# EAGLE design edge (EAGLE 9.2.2)
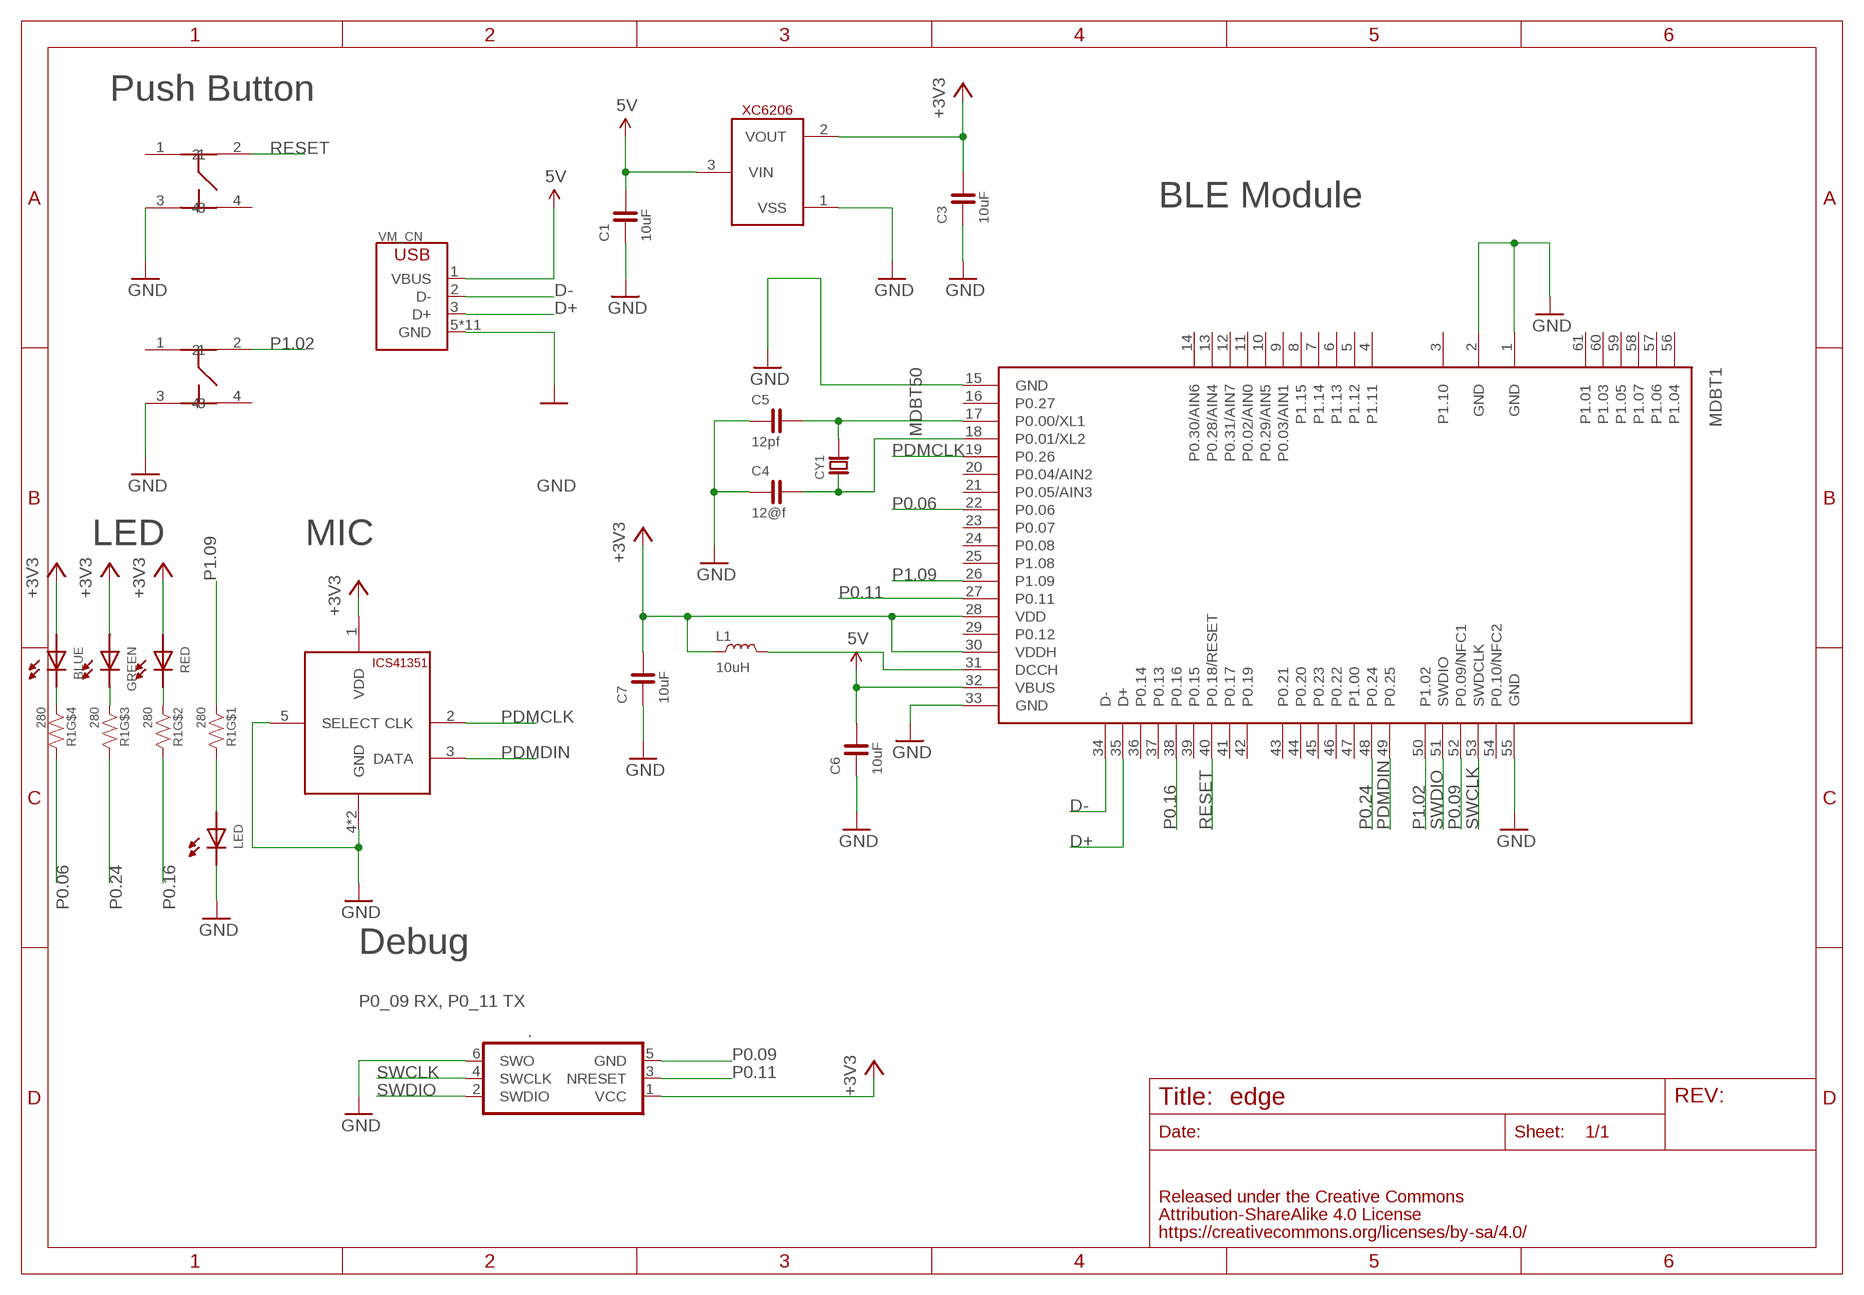
[diagram p0: schematic, sheet 1]

## Parts
.  TC2030-IDC-NL  [TC2030-IDC-NL]
BLUE  LED-0603  [0603]
C1  10uF  CAPACITOR-0603  [0603]
C3  10uF  CAPACITOR-0603  [0603]
C4  12@f  CAPACITOR-0603  [0603]
C5  12pf  CAPACITOR-0603  [0603]
C6  10uF  CAPACITOR-0603  [0603]
C7  10uF  CAPACITOR-0603  [0603]
CY1  CRYSTAL-ABS07  [ABRACON-ABS07-32.768KHZ]
GREEN  LED-0603  [0603]
IC1  XC6206  [SOT-23]
L1  10uH  COIL-0603  [0603]
LED  LED-0603  [0603]
MDBT1  MDBT50  [MDBT50]
MIC1  TDK-ICS41351  [ICS41351]
R1  280  RESISTOR_ARRAY  [EXBV8V]
RED  LED-0603  [0603]
U$1  SWICTH-4P(KMR2)  [SWITCH-4P(KMR2)]
U$5  SWICTH-4P(KMR2)  [SWITCH-4P(KMR2)]
VM_CN  USB-ZX62D  [ZX62D-B-5PA8]

## Nets
5V: C1.2 C6.2 IC1.3(VIN) MDBT1.32(VBUS) VM_CN.1(VBUS)
+3V3: ..1(VCC) BLUE.ANODE C3.2 C7.2 GREEN.ANODE IC1.2(VOUT) L1.1 MDBT1.28(VDD) MDBT1.30(VDDH) MIC1.1(VDD) RED.ANODE
D+: MDBT1.35(D+) VM_CN.3(D+)
D-: MDBT1.34(D-) VM_CN.2(D-)
GND: ..6(SWO) C1.1 C3.1 C4.1 C5.1 C6.1 C7.1 IC1.1(VSS) LED.CATHODE MDBT1.1(GND) MDBT1.2(GND) MDBT1.15(GND) MDBT1.33(GND) MDBT1.55(GND) MIC1.4(GND) MIC1.5(SELECT) MIC1.6(GND) U$1.3 U$5.3 VM_CN.5(GND) VM_CN.B1(GND) VM_CN.B2(GND) VM_CN.B3(GND) VM_CN.B4(GND) VM_CN.T1(GND) VM_CN.T2(GND) VM_CN.T3(GND) VM_CN.T4(GND) VM_CN.T5(GND) VM_CN.T6(GND)
N$1: BLUE.CATHODE R1.4
N$2: GREEN.CATHODE R1.3
N$3: R1.2 RED.CATHODE
N$4: L1.2 MDBT1.31(DCCH)
N$5: LED.ANODE R1.8
N$7: C5.2 CY1.P$2 MDBT1.17(P0.00/XL1)
N$8: C4.2 CY1.P$1 MDBT1.18(P0.01/XL2)
P0.06: MDBT1.22(P0.06) R1.5
P0.09: ..5(GND) MDBT1.52(P0.09/NFC1)
P0.11: ..3(NRESET) MDBT1.27(P0.11)
P0.16: MDBT1.38(P0.16) R1.7
P0.24: MDBT1.48(P0.24) R1.6
P1.02: MDBT1.50(P1.02) U$1.2
P1.09: MDBT1.26(P1.09) R1.1
PDMCLK: MDBT1.19(P0.26) MIC1.2(CLK)
PDMDIN: MDBT1.49(P0.25) MIC1.3(DATA)
RESET: MDBT1.40(P0.18/RESET) U$5.2
SWCLK: ..4(SWCLK) MDBT1.53(SWDCLK)
SWDIO: ..2(SWDIO) MDBT1.51(SWDIO)
Unconnected: MDBT1.3(P1.10) MDBT1.4(P1.11) MDBT1.5(P1.12) MDBT1.6(P1.13) MDBT1.7(P1.14) MDBT1.8(P1.15) MDBT1.9(P0.03/AIN1) MDBT1.10(P0.29/AIN5) MDBT1.11(P0.02/AIN0) MDBT1.12(P0.31/AIN7) MDBT1.13(P0.28/AIN4) MDBT1.14(P0.30/AIN6) MDBT1.16(P0.27) MDBT1.20(P0.04/AIN2) MDBT1.21(P0.05/AIN3) MDBT1.23(P0.07) MDBT1.24(P0.08) MDBT1.25(P1.08) MDBT1.29(P0.12) MDBT1.36(P0.14) MDBT1.37(P0.13) MDBT1.39(P0.15) MDBT1.41(P0.17) MDBT1.42(P0.19) MDBT1.43(P0.21) MDBT1.44(P0.20) MDBT1.45(P0.23) MDBT1.46(P0.22) MDBT1.47(P1.00) MDBT1.54(P0.10/NFC2) MDBT1.56(P1.04) MDBT1.57(P1.06) MDBT1.58(P1.07) MDBT1.59(P1.05) MDBT1.60(P1.03) MDBT1.61(P1.01) U$1.1 U$1.4 U$5.1 U$5.4

## Notes on the sheet
- Push Button
- BLE Module
- LED | MIC
- Debug
- P0_09 RX, P0_11 TX

## Library data of the parts
. = TagConnect:TC2030-IDC: Tag-Connect In Circuit Programming & Debug Cable 6 Pin http://www.tag-connect.com
BLUE GREEN LED RED = FaBo-LED:LED
C1 C3-C7 = FaBo-Capacitor:CAPACITOR: CAPACITOR
CY1 = FaBo-Crystal:CRYSTAL
IC1 = FaBo-VoltageRegulator:XC6206
L1 = FaBo-Coil:COIL: RESISTOR
MDBT1 = MDBT50Q_171031:MDBT50: Raytac Corporation MDBT50 Bluetooth Low Energy Module based on Noridc nRF52840 Source: Raytac datasheet
MIC1 = FaBo-Sound:TDK-ICS41351
R1 = component:RESISTOR_ARRAY
U$1 U$5 = gclue-test:SWICTH-4P(KMR2)
VM_CN = component:USB

## Board
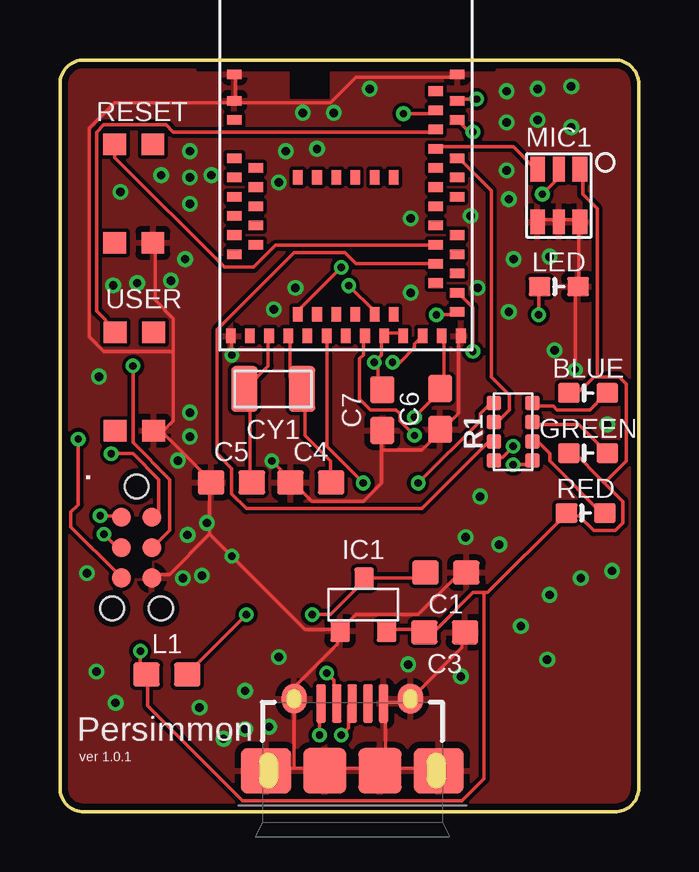
[diagram p1: board, top side]
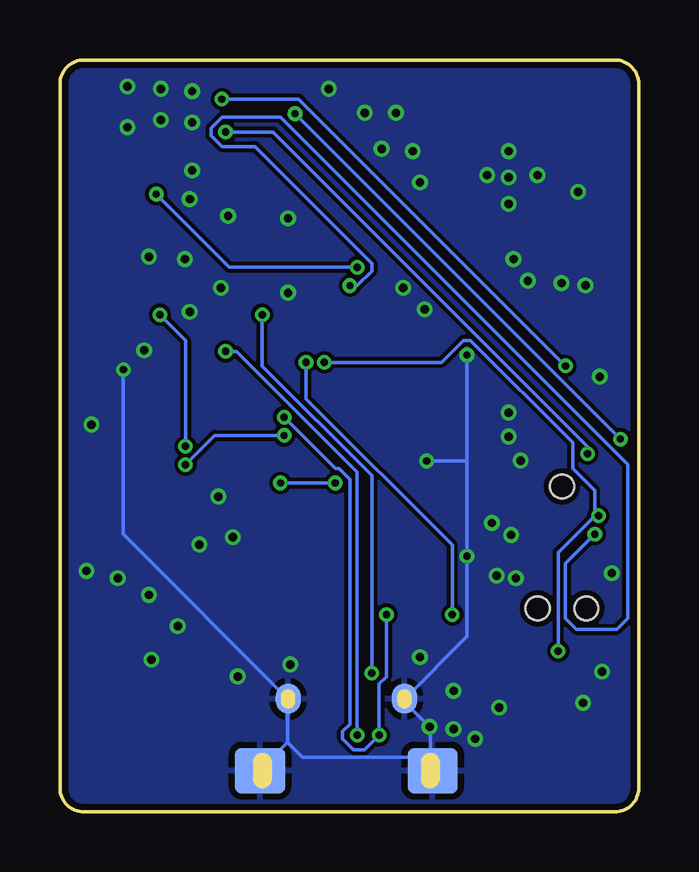
[diagram p2: board, bottom side, seen from below]

Size 24.13 x 31.35 mm. Coordinates in mm from the lower left corner, seen from the top.
Outline: 24.13,30.35 24.13,1 arc-90 23.13,0 1,0 arc-90 0,1 0,30.35 arc-90 1,31.35 23.13,31.35 arc-90 24.13,30.35
Copper layers (1*16): Top 0.035mm / dielectric 1.5mm / Bottom 0.035mm
Design rules "SeeedStudio_2layer_DRU_no_angle_20140221": minimum track width 6mil, minimum drill 12mil, track to track 6mil, track to pad 6mil, pad to pad 6mil, via to via 6mil, smd to smd 0mil, copper to edge 10mil, drill to drill 10mil, minimum pad ring 10mil, minimum via ring 6mil, stop-mask expansion 2mil, vias tented up to drill 100mil, thermal gap 10mil

### Footprints (pad centres in the part's own frame; a part is rotated, then mirrored left to right if it is on the bottom)
TC2030-IDC-NL = smd 0.787 x 0.787: 1 -1.27,-0.635; 2 -1.27,0.635; 3 0,-0.635; 4 0,0.635; 5 1.27,-0.635; 6 1.27,0.635 | hole 0.991: -2.54,0; 2.54,1.016; 2.54,-1.016
0603 = smd 0.9 x 0.8: ANODE -0.8,0; CATHODE 0.8,0
0603' = smd 1.1 x 1: 1 -0.85,0; 2 0.85,0
ABRACON-ABS07-32.768KHZ = smd 1.1 x 1.9: P$1 -1.2,0; P$2 1.2,0
SOT-23 = smd 0.8 x 0.9: 1 -0.97,-1.1; 2 0.97,-1.1; 3 0.03,1.1
MDBT50 = smd 0.6 x 0.4: 1 -4.65,3.75; 2 -4.65,2.65; 3 -4.65,1.85; 4 -4.65,0.25; 5 -3.75,-0.15; 6 -4.65,-0.55; 7 -3.75,-0.95; 8 -4.65,-1.35; 9 -3.75,-1.75; 10 -4.65,-2.15; 11 -3.75,-2.55; 12 -4.65,-2.95; 13 -3.75,-3.35; 14 -4.65,-3.75; 34 4.65,-6.15; 35 4.65,-5.35; 36 3.75,-4.95; 37 4.65,-4.55; 38 3.75,-4.15; 39 4.65,-3.75; 40 3.75,-3.35; 41 4.65,-2.95; 42 3.75,-2.55; 43 3.75,-1.75; 44 4.65,-1.35; 45 3.75,-0.95; 46 4.65,-0.55; 47 3.75,-0.15; 48 4.65,0.25; 49 3.75,0.65; 50 3.75,1.45; 51 4.65,1.85; 52 3.75,2.25; 53 4.65,2.65; 54 3.75,3.05; 55 4.65,3.75 | smd 0.4 x 0.6: 15 -4.8,-7.15; 16 -4,-7.15; 17 -3.2,-7.15; 18 -2.4,-7.15; 19 -2,-6.25; 20 -1.6,-7.15; 21 -1.2,-6.25; 22 -0.8,-7.15; 23 -0.4,-6.25; 24 0,-7.15; 25 0.4,-6.25; 26 0.8,-7.15; 27 1.2,-6.25; 28 1.6,-7.15; 29 2,-6.25; 30 2.4,-7.15; 31 3.2,-7.15; 32 4,-7.15; 33 4.8,-7.15; 56 -2,-0.55; 57 -1.2,-0.55; 58 -0.4,-0.55; 59 0.4,-0.55; 60 1.2,-0.55; 61 2,-0.55
ICS41351 = smd 0.622 x 1.03: 1 0.884,1.1; 3 -0.884,1.1; 4 -0.884,-1.1; 6 0.884,-1.1 | smd 0.5 x 1.03: 2 0,1.1; 5 0,-1.1
EXBV8V = smd 0.6 x 0.6: 1 -1.2,-0.8; 2 -0.4,-0.8; 3 0.4,-0.8; 4 1.2,-0.8; 5 1.2,0.8; 6 0.4,0.8; 7 -0.4,0.8; 8 -1.2,0.8
SWITCH-4P(KMR2) = smd 0.9 x 0.95: 1 -1,0; 2 3.1,0; 3 -1,-1.6; 4 3.1,-1.6
ZX62D-B-5PA8 = smd 0.4 x 1.6: 1 -1.3,4.25; 2 -0.65,4.25; 3 0,4.25; 4 0.65,4.25; 5 1.3,4.25 | smd 1.05 x 1.25 bottom: B1 -2.425,4.45; B2 2.425,4.45 | smd 2.1 x 1.9 bottom: B3 -3.6,1.45; B4 3.6,1.45 | smd 1.05 x 1.25: T1 -2.425,4.45; T2 2.425,4.45 | smd 2.1 x 1.9: T3 -3.6,1.45; T6 3.6,1.45 | smd 1.8 x 1.9: T4 -1.15,1.45; T5 1.15,1.45

### Placement (x,y rotation side)
.  3.19,11.03 270 top
BLUE  22.02,17.47 0 top
C1  10uF  [0603']  16.09,9.98 180 top
C3  10uF  [0603']  16.04,7.49 180 top
C4  12@f  [0603']  10.46,13.74 0 top
C5  12pf  [0603']  7.15,13.74 0 top
C6  10uF  [0603']  15.85,16.8 90 top
C7  10uF  [0603']  13.44,16.75 90 top
CY1  8.89,17.64 180 top
GREEN  22.02,14.96 0 top
IC1  12.65,8.64 0 top
L1  10uH  [0603']  4.46,5.73 0 top
LED  20.8,21.9 0 top
MDBT1  11.92,27 0 top
MIC1  20.8,25.7 0 top
R1  18.9,15.85 90 top
RED  21.92,12.46 0 top
U$1  2.3,16.9 90 top
U$5  2.28,24.73 90 top
VM_CN  12.19,0.27 0 top

### Tracks (layer width: path | path; a pad name or v marks a point on that pad's centre or on a via)
5V  (via drill 0.3)
  Top 0.152: MDBT1.32 16,19.81 16,17.68 C6.2 15.85,17.53 v14.78,16.46 | C1.2 15.24,9.91 15.09,9.75 12.8,9.75 IC1.3 12.65,9.6 11.28,8.23 v10.52,8.23 | v10.82,3.2 10.82,4.42 VM_CN.1
  Bottom 0.152: v10.52,8.23 10.52,5.64 10.82,5.33 v10.82,3.2 11.43,2.59 11.89,2.59 12.34,3.05 12.34,3.35 12.04,3.66 12.04,13.87 12.5,14.33 12.65,14.33 v14.78,16.46
+3V3  (via drill 0.3)
  Top 0.152: MDBT1.30 14.17,19.96 13.56,19.96 MDBT1.28 13.41,19.81 13.41,19.05 13.26,18.9 13.26,18.75 | 13.26,18.75 13.26,17.83 13.41,17.68 C7.2 | v1.68,12.34 2.44,12.34 ..1 | v3.35,6.71 3.35,5.94 3.5,5.79 L1.1 3.66,5.64 3.66,4.42 7.62,0.46 16.76,0.46 17.68,1.37 17.68,9.14 | v13.11,18.75 13.26,18.75 | IC1.2 13.72,7.62 15.09,7.62 C3.2 15.24,7.62 15.7,7.62 17.22,9.14 17.68,9.14 | 22.71,13.72 21.34,15.09 GREEN.ANODE | 22.71,13.72 23.47,12.95 23.47,12.04 23.16,11.73 22.25,11.73 21.64,12.34 21.18,12.34 RED.ANODE 21.03,12.34 17.83,9.14 17.68,9.14 | 22.4,18.14 23.32,18.14 23.62,17.83 23.62,14.63 22.71,13.72 | 22.4,18.14 22.25,18.14 21.64,17.53 21.34,17.53 BLUE.ANODE | 22.4,18.14 22.4,25.15 21.79,25.76 21.79,26.67 MIC1.1
  Bottom 0.152: 1.83,12.34 3.35,10.82 v3.35,6.71 | v13.11,18.75 8.23,18.75 7.32,19.66 7.01,19.66 2.74,15.39 2.74,14.33 1.83,13.41 1.83,12.34 | 1.83,12.34 v1.68,12.34
D+  (via drill 0.3)
  Top 0.152: v17.22,19.2 17.22,21.03 16.61,21.64 MDBT1.35 | v11.73,3.2 12.04,3.5 12.04,4.42 VM_CN.3
  Bottom 0.152: v17.22,19.2 16.76,19.2 11.73,14.17 v11.73,3.2
D-  (via drill 0.3)
  Top 0.152: v15.7,20.73 16.46,20.73 MDBT1.34 | v11.12,5.79 11.43,5.49 11.43,4.57 VM_CN.2
  Bottom 0.152: v15.7,20.73 15.7,18.59 11.12,14.02 v11.12,5.79
GND  (via drill 0.3, 0.35)
  Top 0.152: MDBT1.33 16.61,19.81 16.61,16.61 16,16 C6.1 15.85,15.85 15.09,15.09 13.41,15.09 | 13.41,15.09 13.41,15.85 C7.1 | 13.41,15.09 13.41,13.72 12.65,12.95 10.52,12.95 9.75,13.72 C4.1 9.6,13.87 v8.84,14.63 | v7.16,19.05 7.16,19.81 MDBT1.15 | MIC1.4 19.96,24.69 20.73,24.69 MIC1.5 20.88,24.69 21.64,24.69 MIC1.6 21.64,24.54 21.64,21.95 LED.CATHODE 21.49,21.79 v21.49,18.44 | IC1.1 11.58,7.47 11.58,7.01 9.91,5.33 9.91,4.72 VM_CN.T1 9.75,4.57 9.75,1.83 | C1.1 16.92,9.91 16.61,9.91 14.94,8.23 12.34,8.23 11.73,7.62 IC1.1 | C3.1 16.76,7.47 16.76,6.86 14.63,4.72 VM_CN.B2 14.48,4.57 13.56,4.57 VM_CN.5 13.56,4.42 13.56,1.83 | VM_CN.T5 13.26,1.83 11.12,1.83 VM_CN.T4 10.97,1.83 9.75,1.83 | 9.75,1.83 8.69,1.83 VM_CN.T3 | 13.56,1.83 13.41,1.83 VM_CN.T5 | 13.56,1.83 15.7,1.83 VM_CN.B4 | 13.56,1.83 VM_CN.T5 | MDBT1.2 7.32,29.72 7.32,30.63 MDBT1.1 | MDBT1.55 16.46,30.63 12.34,30.63 11.28,29.57 7.32,29.57 MDBT1.2 | 6.25,11.58 4.57,9.91 3.96,9.91 ..6 | 6.25,11.58 6.25,13.72 C5.1 6.25,13.87 4.27,15.85 | 4.27,15.85 3.96,15.85 U$1.3 4.27,15.85 | 4.72,19.2 4.72,16.31 4.27,15.85 | 4.72,19.2 4.72,20.57 3.96,21.34 3.96,23.62 U$5.3 | 4.72,19.2 1.83,19.2 1.22,19.81 1.22,28.5 2.29,29.57 7.16,29.57 MDBT1.2 | 6.25,11.58 v7.16,10.67 10.21,7.62 11.58,7.62 IC1.1
  Bottom 0.152: 7.16,14.63 v7.16,10.67 7.16,7.32 9.75,4.72 VM_CN.T1 9.75,4.57 8.69,3.5 8.69,2.29 | 7.16,14.63 v7.16,19.05 | 8.69,2.29 8.69,1.83 VM_CN.T3 8.69,2.29 | 7.16,14.63 v8.84,14.63 | 14.63,2.9 14.63,4.57 VM_CN.B2 14.63,4.72 21.49,11.58 v21.49,18.44 | 14.63,2.9 15.7,1.83 VM_CN.B4 | 8.69,2.29 14.02,2.29 14.63,2.9
  other vias: 20.32,6.35 17.52,13.15 14.62,21.65 9.82,21.85 14.62,24.75 5.42,27.55 5.42,26.45 9.42,27.55 9.12,26.25 5.42,25.35 2.52,25.85 5.22,23.05 4.62,22.15 3.22,22.05 2.22,21.95 5.42,16.65 5.42,15.65 6.12,12.05 8.72,3.55 7.72,3.45 6.82,3.05 10.12,29.15 11.42,29.15 12.92,30.15 18.62,30.05 18.62,28.75 19.92,28.85 19.92,30.15 18.62,26.75 17.12,24.85 17.42,21.85 18.92,23.05 20.42,23.15 18.72,20.85 20.62,19.25 10.72,27.65 6.32,26.55 4.22,26.55 1.62,18.15 4.92,14.65 5.32,11.55 5.92,9.85 5.12,9.75 1.12,9.95 1.52,5.85 2.32,4.55 7.72,5.05 9.12,6.45 5.82,4.35 16.72,5.65 14.52,6.15 23.02,10.05 21.72,9.75 20.42,9.05 19.22,7.75 16.92,11.45 18.32,11.15 22.82,16.15 21.32,30.25 21.32,28.55 18.72,25.55 8.92,20.95
  pour Top: 0,0 24.13,0 24.13,31.75 0,31.75
  pour Bottom: 0,0 24.13,0 24.13,31.75 0,31.75
N$1
  Top 0.152: R1.4 19.81,16.92 20.57,16.92 20.73,16.76 22.1,16.76 22.71,17.37 BLUE.CATHODE
N$2
  Top 0.152: R1.3 19.81,16.15 21.64,16.15 22.71,15.09 GREEN.CATHODE
N$3
  Top 0.152: R1.2 19.81,15.39 19.96,15.39 20.42,14.94 20.42,14.63 22.71,12.34 RED.CATHODE
N$4  (via drill 0.3)
  Top 0.152: v13.87,18.75 14.17,18.75 14.78,19.36 14.78,19.51 15.09,19.81 MDBT1.31 | v7.77,8.23 5.33,5.79 L1.2
  Bottom 0.152: v13.87,18.75 13.87,17.22 7.77,11.12 v7.77,8.23
N$5  (via drill 0.3)
  Top 0.152: v18.9,15.24 18.44,14.78 18.14,14.78 R1.8 | v19.96,20.73 19.96,21.79 LED.ANODE
  Bottom 0.152: v18.9,15.24 18.9,19.66 v19.96,20.73
N$7
  Top 0.152: MDBT1.17 8.69,19.81 8.69,18.59 7.77,17.68 CY1.P$2 7.77,17.53 7.92,17.37 7.92,13.87 C5.2
N$8
  Top 0.152: MDBT1.18 9.6,19.81 9.6,18.14 10.06,17.68 CY1.P$1 10.21,17.53 10.21,15.7 11.28,14.63 11.28,13.87 C4.2
P0.06  (via drill 0.3)
  Top 0.152: v12.65,13.72 11.12,15.24 11.12,19.81 MDBT1.22 | v14.94,13.72 17.53,16.31 17.53,16.61 17.98,17.07 R1.5
  Bottom 0.152: v14.94,13.72 v12.65,13.72
P0.09  (via drill 0.3)
  Top 0.152: v14.33,29.11 15.54,29.11 MDBT1.52 | v0.76,15.54 0.76,12.8 0.46,12.5 0.46,11.89 2.44,9.91 ..5
  Bottom 0.152: v0.76,15.54 v14.33,29.11
P0.11  (via drill 0.3)
  Top 0.152: v12.04,21.95 13.11,20.88 MDBT1.27 | v1.83,11.58 2.44,10.97 ..3
  Bottom 0.152: v12.04,21.95 11.73,21.95 11.12,22.55 11.12,22.86 16,27.74 17.37,27.74 17.83,28.19 17.83,28.5 17.37,28.96 14.94,28.96 0.46,14.48 0.46,8.08 0.91,7.62 2.59,7.62 3.05,8.08 3.05,10.36 v1.83,11.58
P0.16
  Top 0.152: MDBT1.38 15.54,22.86 12.34,22.86 11.89,23.32 9.75,23.32 6.55,20.12 6.55,14.94 7.16,14.33 7.16,13.26 7.77,12.65 15.09,12.65 17.98,15.54 R1.7
P0.24
  Top 0.152: MDBT1.48 16.61,27.13 16.76,27.13 17.98,25.91 17.98,18.14 18.75,17.37 18.75,16.76 18.14,16.15 R1.6
P1.02
  Top 0.152: MDBT1.50 15.54,28.35 4.72,28.35 4.42,28.65 1.83,28.65 1.52,28.35 1.52,20.88 2.29,20.12 U$1.2
P1.09  (via drill 0.3)
  Top 0.152: v14.78,15.7 14.17,16.31 14.17,16.61 14.02,16.76 12.95,16.76 12.5,17.22 12.5,18.9 12.65,19.05 12.65,19.81 MDBT1.26 | v18.9,14.48 19.51,14.48 19.66,14.63 R1.1
  Bottom 0.152: v14.78,15.7 17.68,15.7 v18.9,14.48
PDMCLK  (via drill 0.3)
  Top 0.152: v11.73,22.71 10.06,21.03 10.06,20.88 MDBT1.19 | v20.12,25.76 20.73,26.36 20.73,26.67 MIC1.2
  Bottom 0.152: v11.73,22.71 17.07,22.71 v20.12,25.76
PDMDIN
  Top 0.152: MDBT1.49 15.7,27.74 18.9,27.74 19.81,26.82 MIC1.3
RESET
  Top 0.152: MDBT1.40 15.54,23.62 8.99,23.62 8.08,22.71 6.86,22.71 2.29,27.28 2.29,27.74 U$5.2
SWCLK  (via drill 0.3)
  Top 0.152: v17.37,29.72 16.61,29.72 MDBT1.53 | v3.05,18.59 3.05,15.39 4.57,13.87 4.57,11.73 3.96,11.12 ..4
  Bottom 0.152: v17.37,29.72 14.17,29.72 v3.05,18.59
SWDIO  (via drill 0.3)
  Top 0.152: v17.22,28.35 17.07,28.35 16.61,28.8 MDBT1.51 | v2.13,14.94 3.05,14.94 4.12,13.87 4.12,12.5 3.96,12.34 ..2
  Bottom 0.152: v17.22,28.35 15.24,28.35 2.13,15.24 v2.13,14.94

### Text on the board
tPlace: RESET | USER | Persimmon | ver 1.0.1